# EAGLE design vacuum_gripper_v1 (EAGLE 9.6.0)
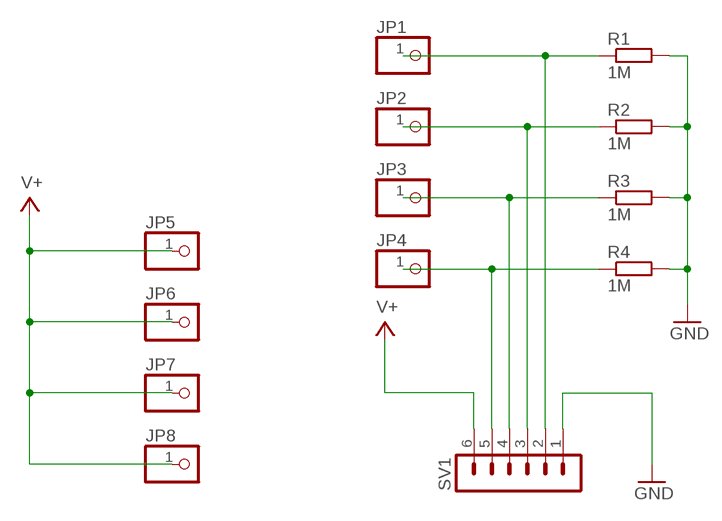
[diagram p0: schematic, sheet 1]

## Parts
JP1  PINHD-1X1  [1X01]
JP2  PINHD-1X1  [1X01]
JP3  PINHD-1X1  [1X01]
JP4  PINHD-1X1  [1X01]
JP5  PINHD-1X1  [1X01]
JP6  PINHD-1X1  [1X01]
JP7  PINHD-1X1  [1X01]
JP8  PINHD-1X1  [1X01]
R1  1M  R-EU_R1206  [R1206]
R2  1M  R-EU_R1206  [R1206]
R3  1M  R-EU_R1206  [R1206]
R4  1M  R-EU_R1206  [R1206]
SV1  MA06-1  [MA06-1]

## Nets
GND: R1.2 R2.2 R3.2 R4.2 SV1.1
N$1: JP1.1 R1.1 SV1.2
N$3: JP2.1 R2.1 SV1.3
N$4: JP3.1 R3.1 SV1.4
N$5: JP4.1 R4.1 SV1.5
V+: JP5.1 JP6.1 JP7.1 JP8.1 SV1.6

## Library data of the parts
JP1-JP8 = pinhead:PINHD-1X1: PIN HEADER
R1-R4 = rcl:R-EU_: RESISTOR, European symbol; SPICEPREFIX: R
SV1 = con-lstb:MA06-1: PIN HEADER; OC_FARNELL: unknown; OC_NEWARK: unknown

## Board
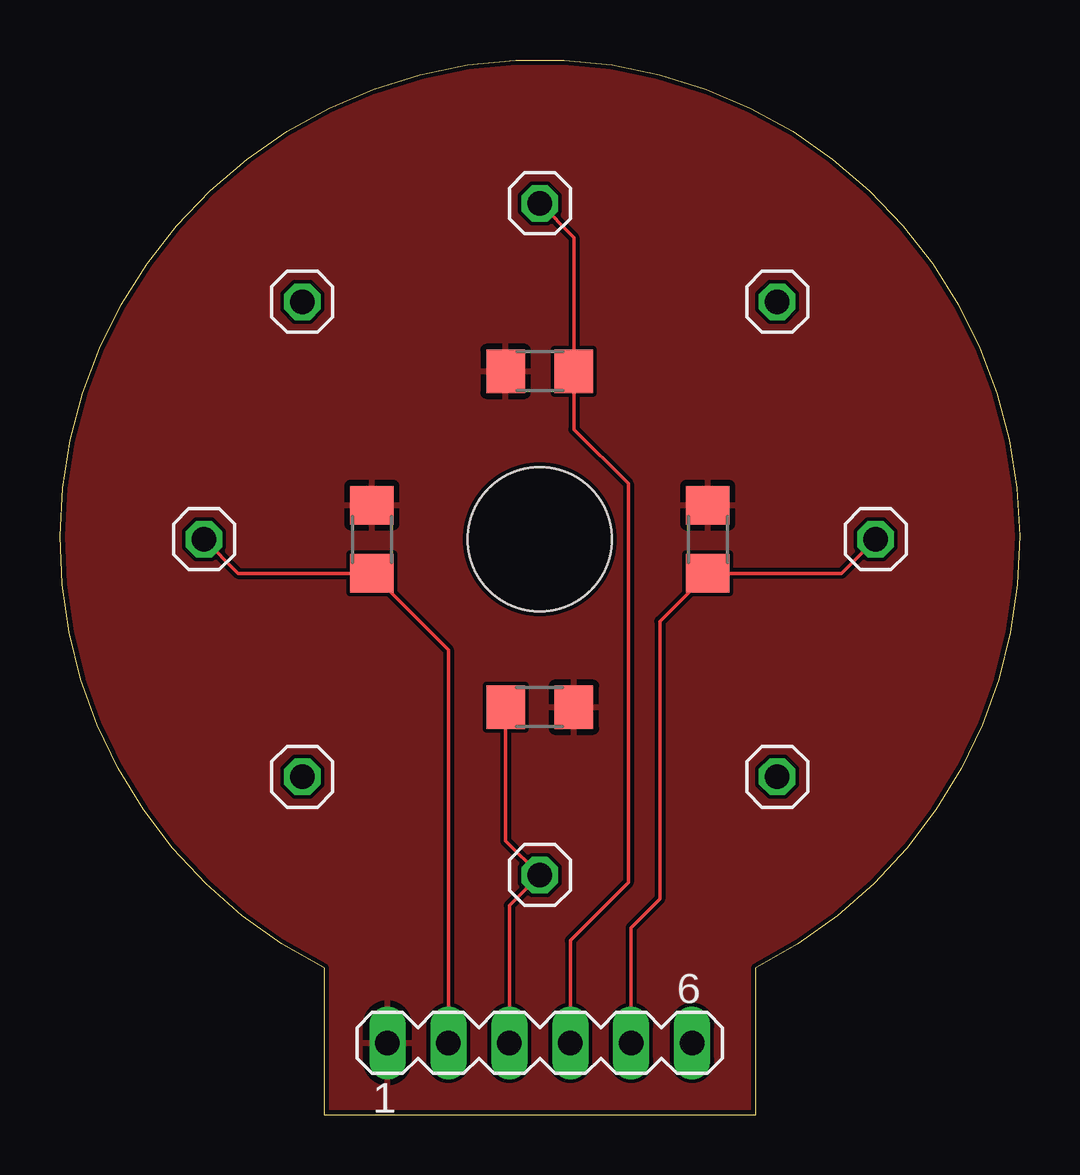
[diagram p1: board, top side]
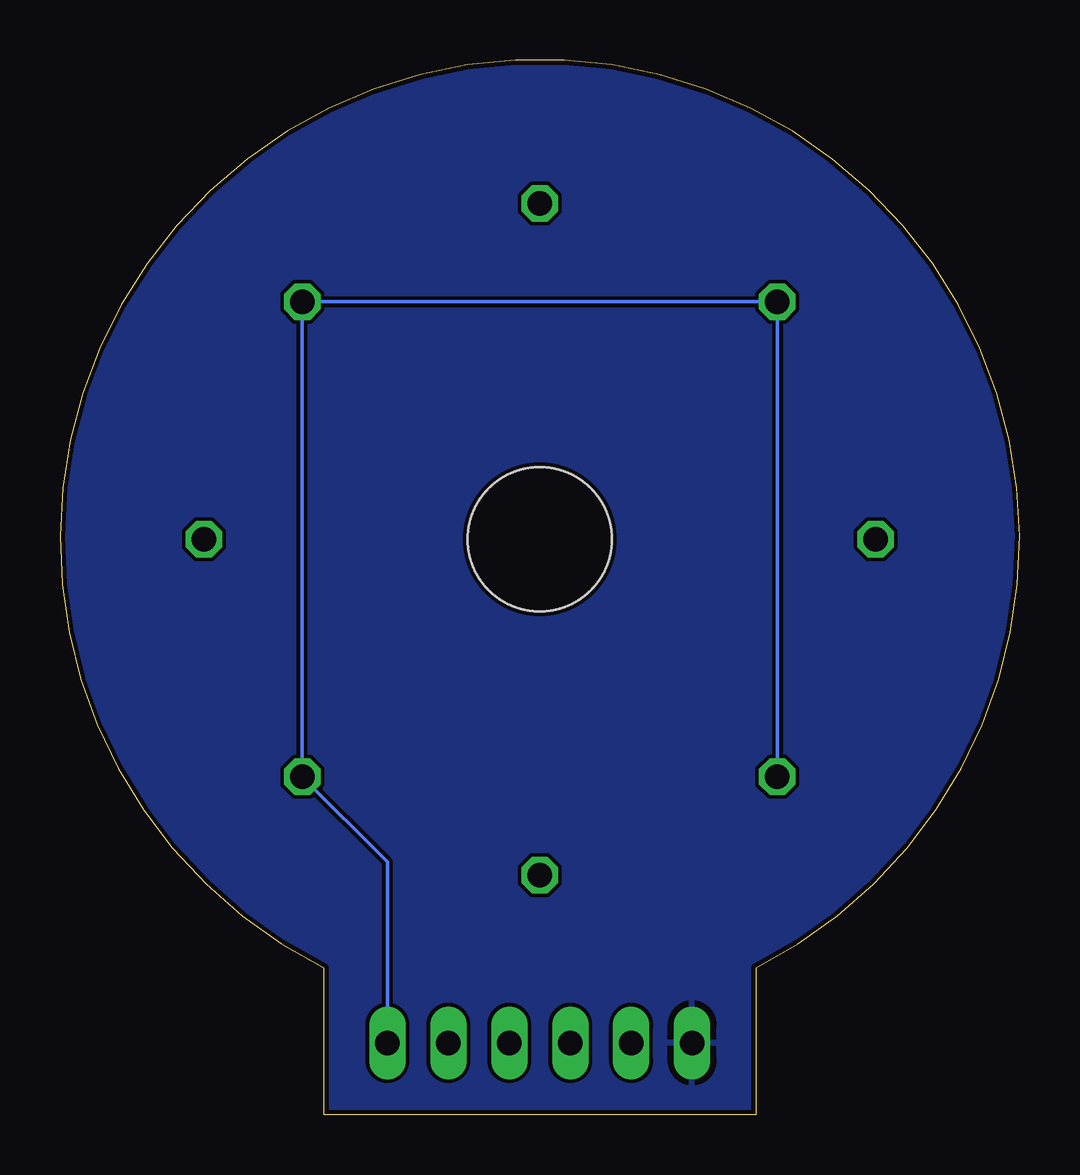
[diagram p2: board, bottom side, seen from below]

Size 40 x 43.98 mm. Coordinates in mm from the lower left corner, seen from the top.
Outline: 11,6.14 11,0 29,0 29,6.14 arc307 11,6.14
Copper layers (1*16): Top 0.035mm / dielectric 1.5mm / Bottom 0.035mm
Design rules "PCBGoGo": minimum track width 6mil, minimum drill 0.2mm, track to track 6mil, track to pad 6mil, pad to pad 6mil, via to via 6mil, smd to smd 6mil, copper to edge 0.2mm, drill to drill 6mil, minimum pad ring 10mil, minimum via ring 8mil, stop-mask expansion 4mil, vias tented up to drill 0mil, thermal gap 10mil
Holes 6 mm at 20,24

### Footprints (pad centres in the part's own frame; a part is rotated, then mirrored left to right if it is on the bottom)
1X01 = drill 1.016 octagon: 1 0,0
R1206 = smd 1.6 x 1.803: 1 -1.422,0; 2 1.422,0
MA06-1 = drill 1.016 long: 1 -6.35,0; 2 -3.81,0; 3 -1.27,0; 4 1.27,0; 5 3.81,0; 6 6.35,0

### Placement (x,y rotation side)
JP1  6,24 0 top
JP2  20,10 0 top
JP3  20,38 0 top
JP4  34,24 0 top
JP5  10.1,33.9 0 top
JP6  29.9,33.9 0 top
JP7  29.9,14.1 0 top
JP8  10.1,14.1 0 top
R1  13,24 90 top
R2  20,17 0 top
R3  20,31 180 top
R4  27,24 90 top
SV1  20,3 0 top

### Tracks (layer width: path | path; a pad name or v marks a point on that pad's centre or on a via)
GND
  pour Bottom: -7,50 48,50 48,-3 -7,-3
  pour Top: 47,48 -3,48 -3,-1 47,-1
N$1
  Top 0.152: JP1.1 7.42,22.58 R1.1 16.19,19.39 SV1.2
N$3
  Top 0.152: R2.1 18.58,11.42 JP2.1 18.73,8.73 SV1.3
N$4
  Top 0.152: JP3.1 21.42,36.58 R3.1 21.42,28.58 23.69,26.31 23.69,9.69 21.27,7.27 SV1.4
N$5
  Top 0.152: SV1.5 23.81,7.81 25,9 25,20.58 R4.1 32.58,22.58 JP4.1
V+
  Bottom 0.152: SV1.6 26.35,10.55 JP7.1 JP6.1 JP5.1 JP8.1

### Text on the board
Document: PIN3 | V+ | V+ | PIN1 | PIN4 | V+ | V+ | PIN2 | Ikemoto Lab | GND | 1 | 2 | 3 | 4 | V+